# EAGLE design PCB-CMB-4 (EAGLE 7.5.0)

## Sheet 1 of 2
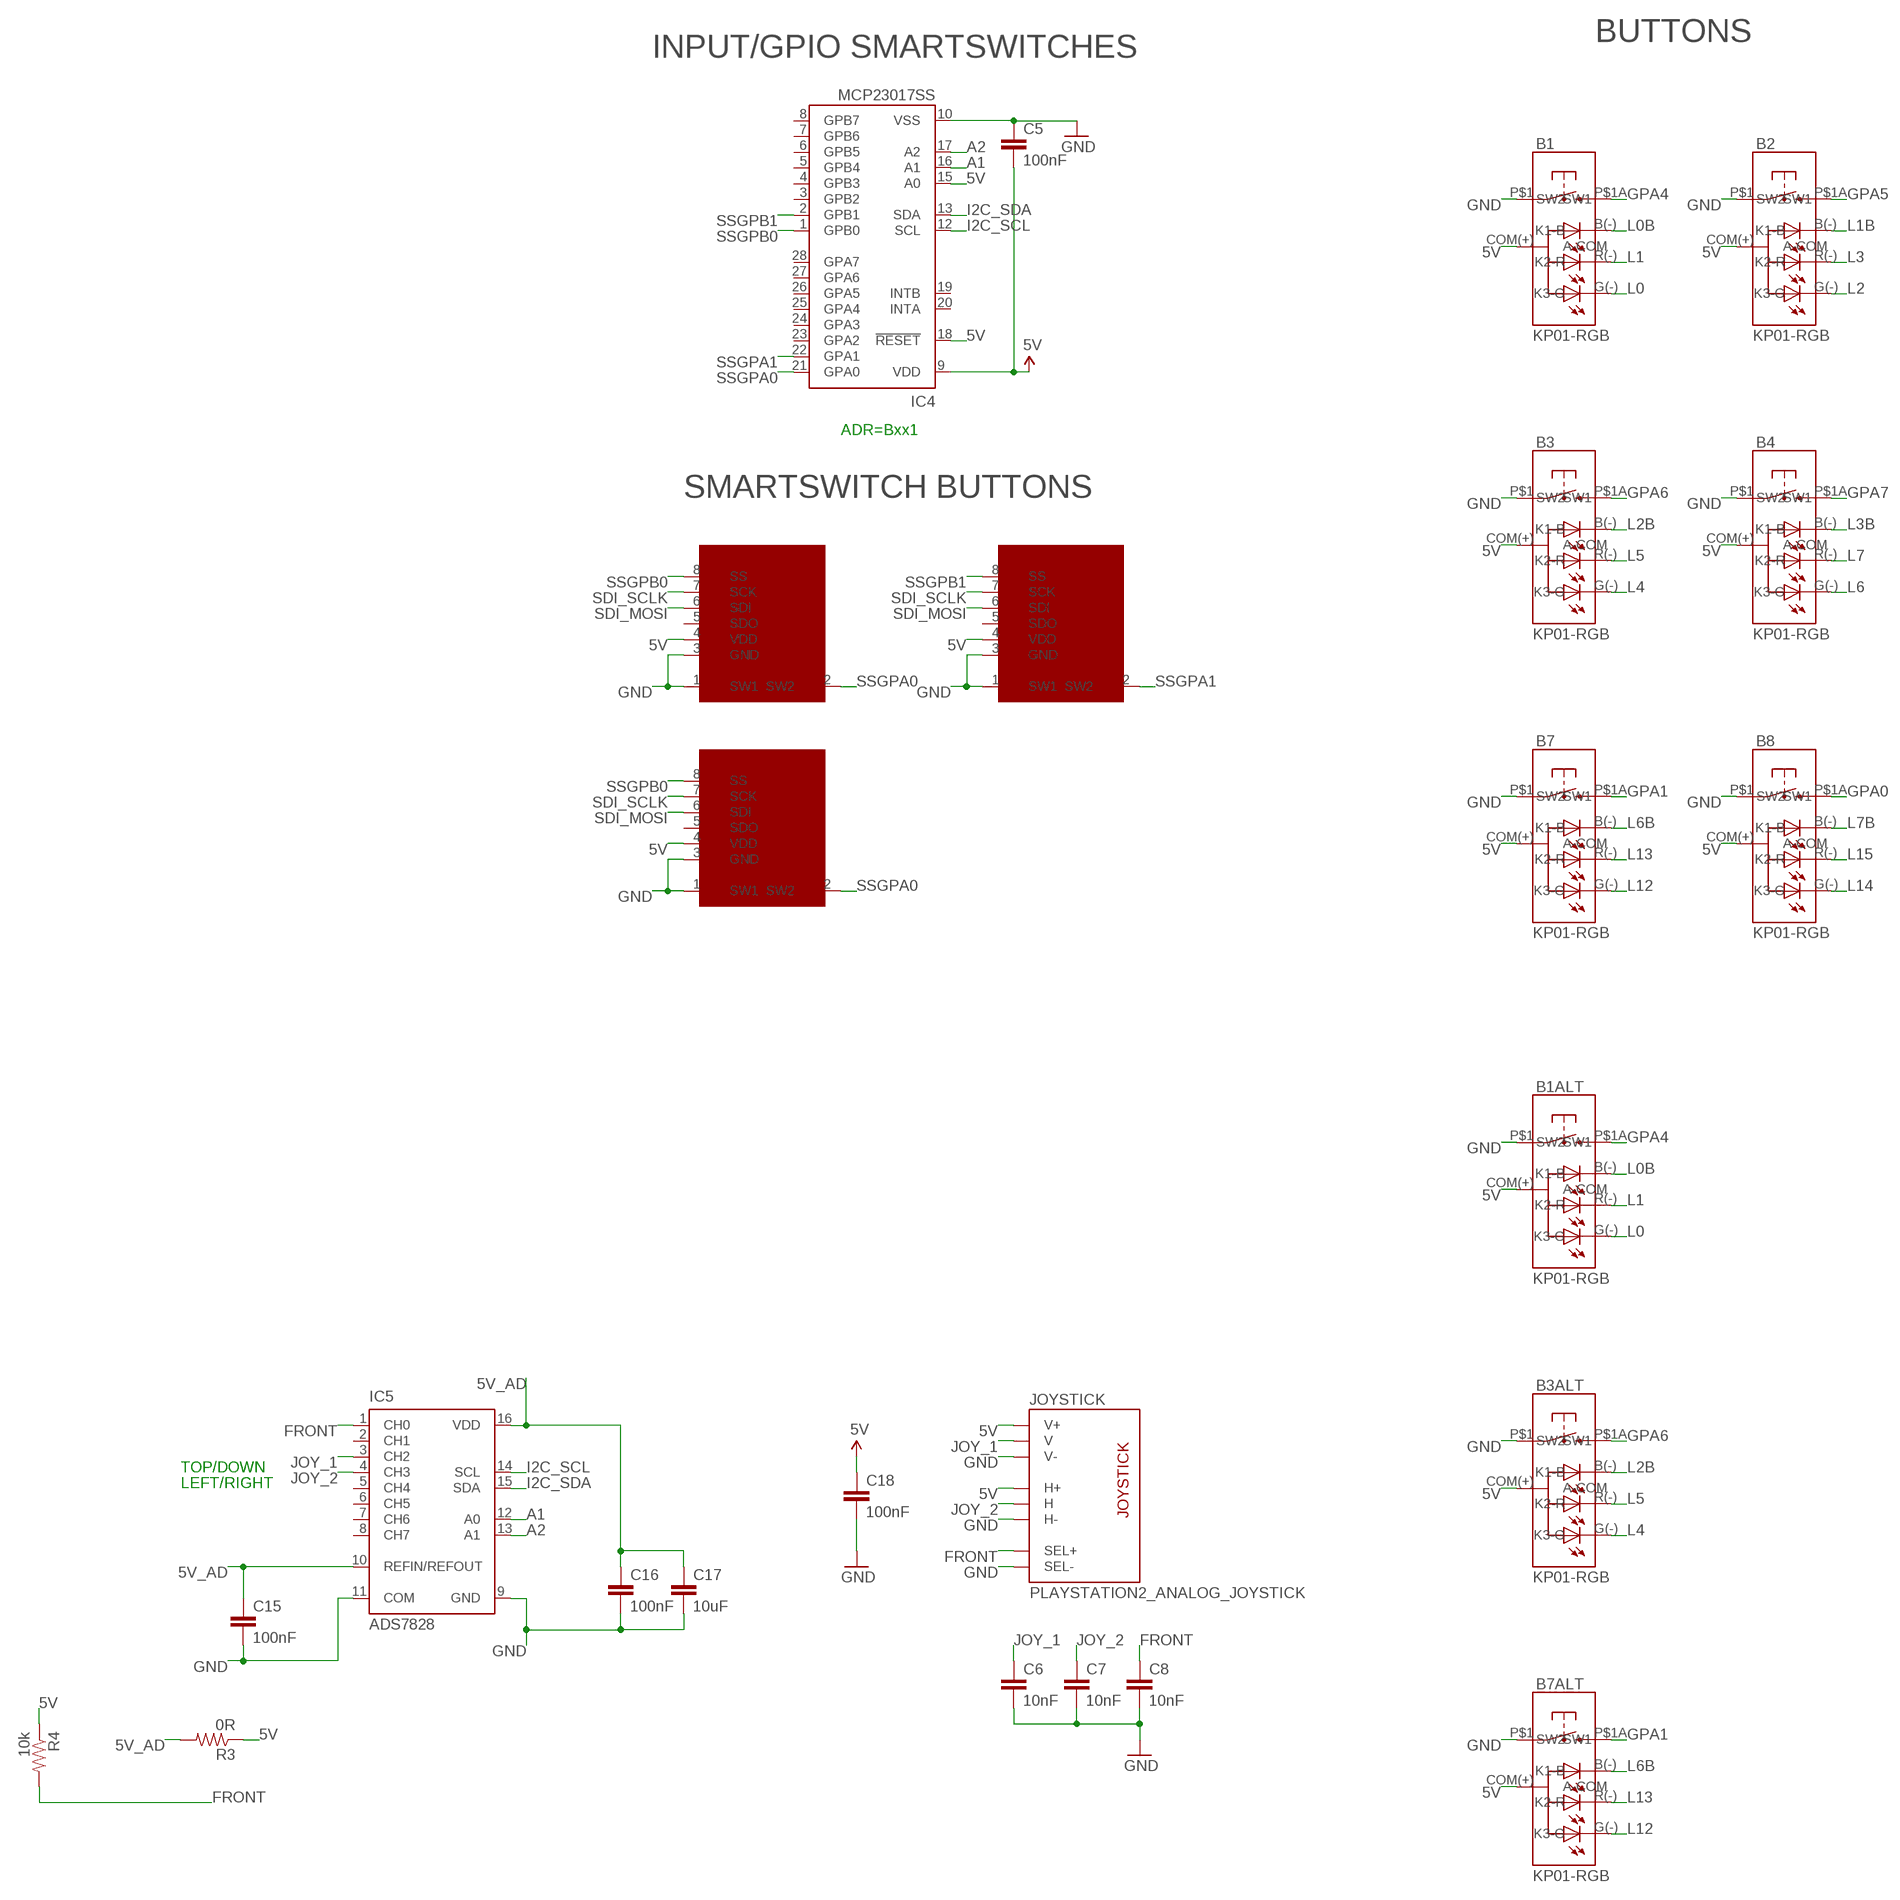
[diagram p0: schematic, sheet 1, part 1 of 2]
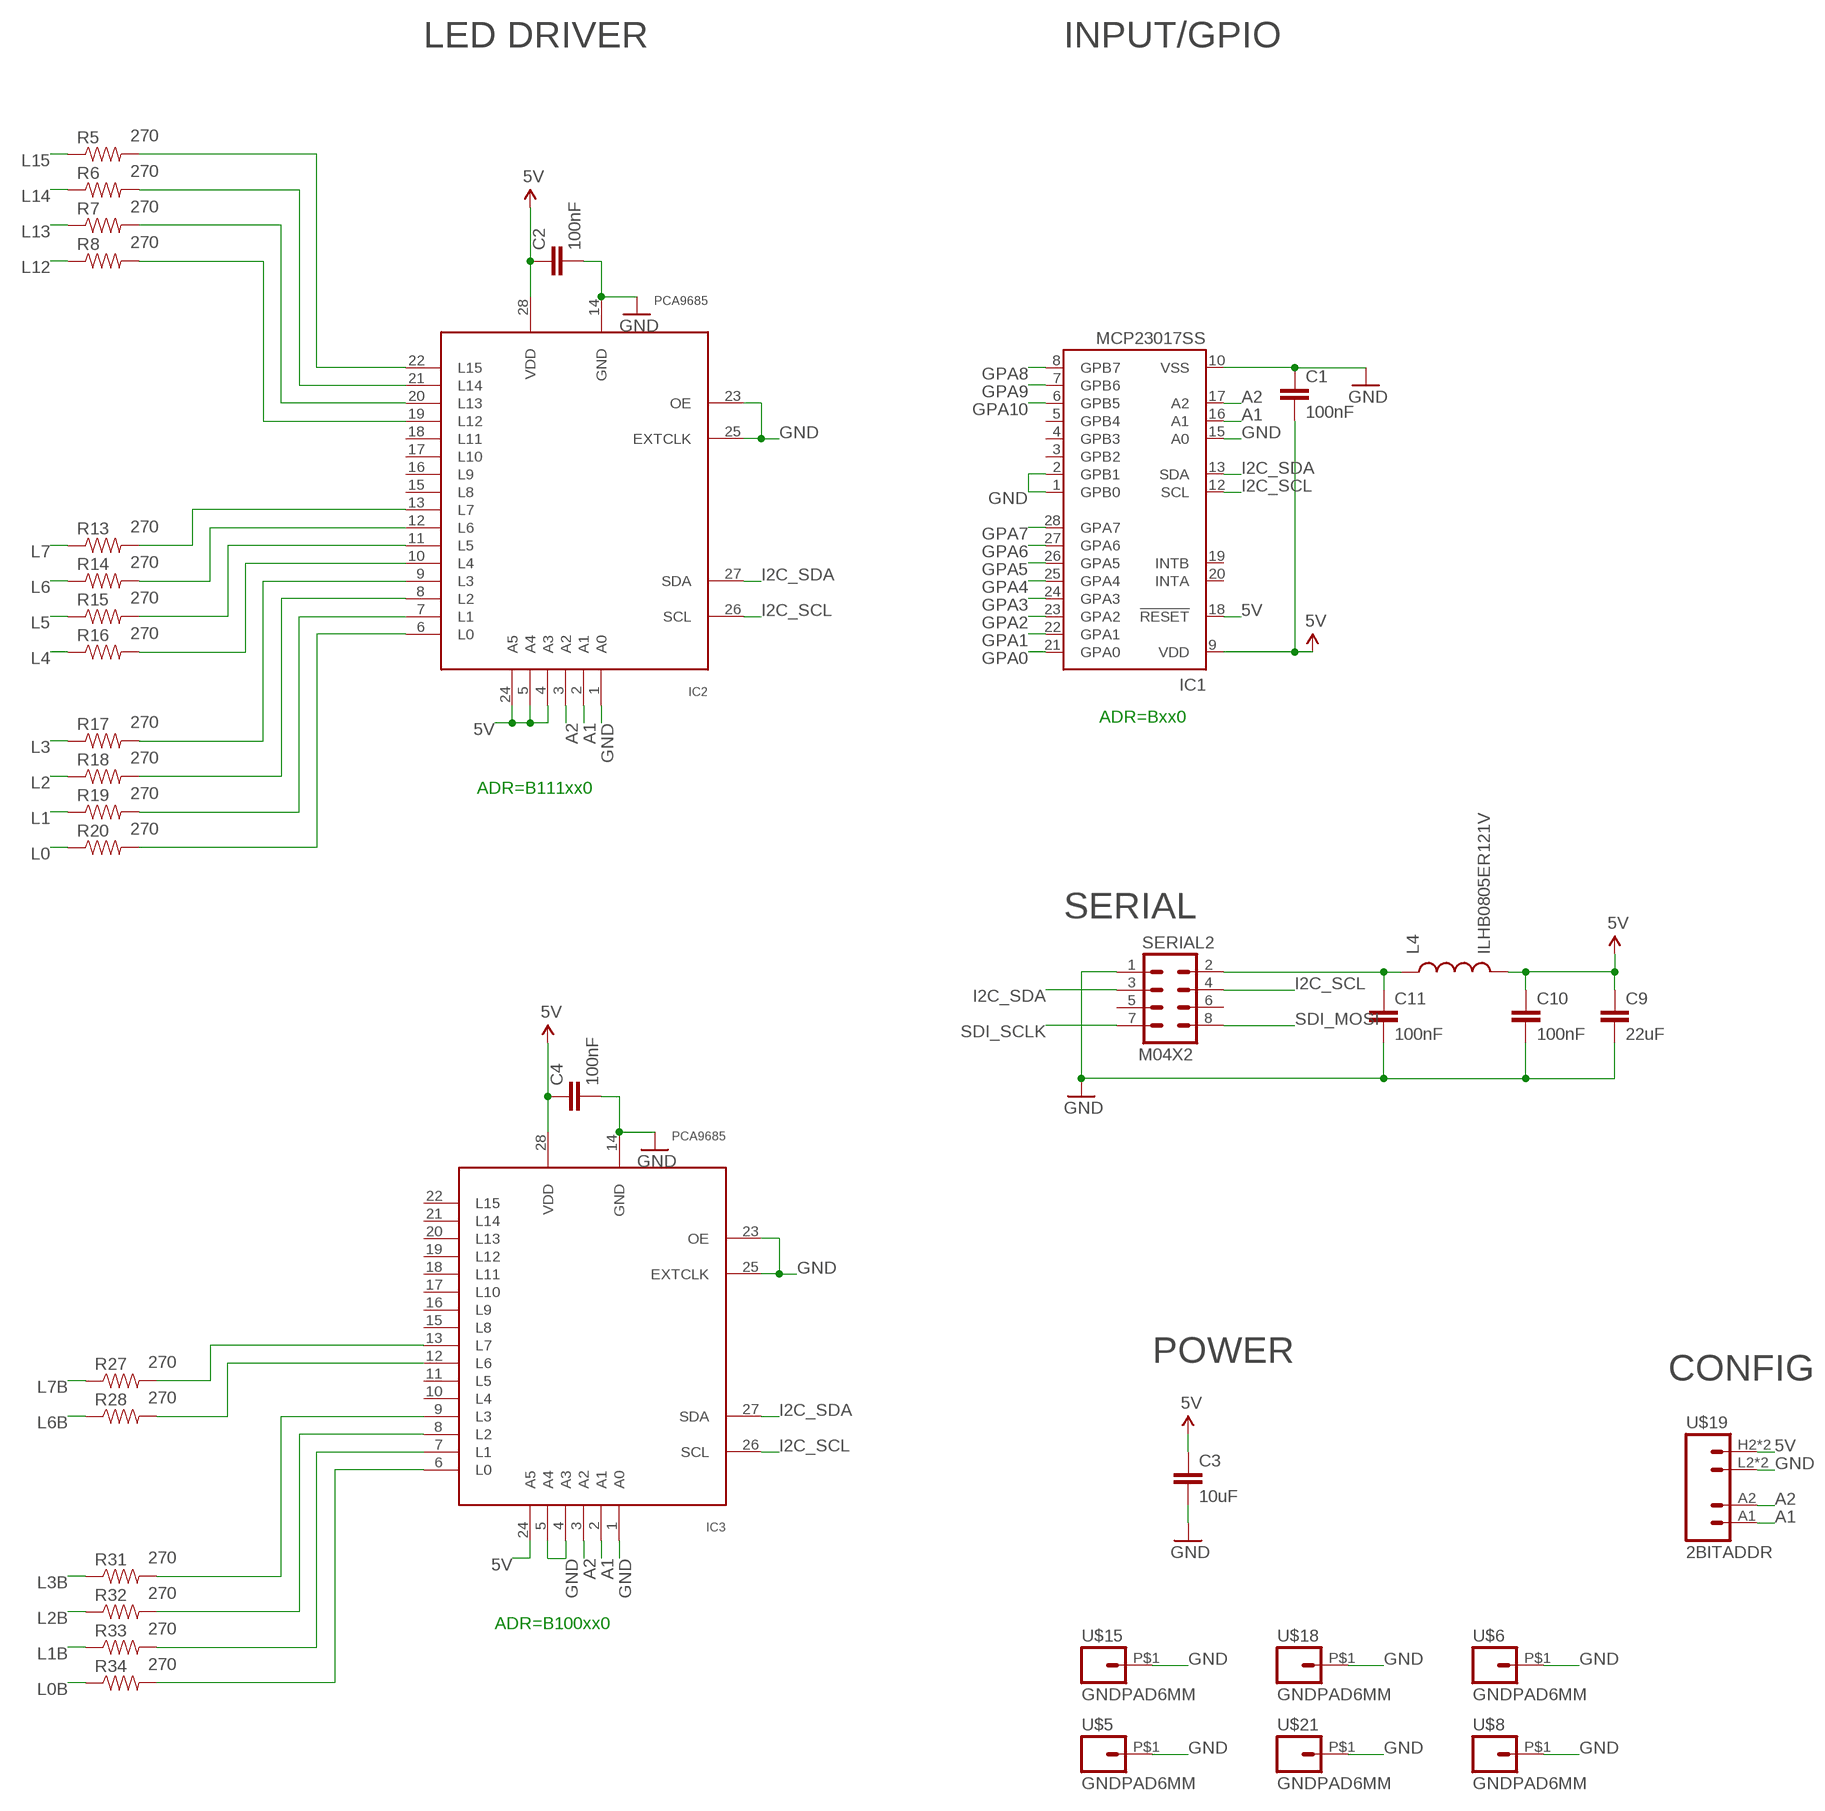
[diagram p1: schematic, sheet 1, part 2 of 2]

### Parts
B1  KP01-RGB  NKK-KP01  [NKK-KP01]
B1ALT  KP01-RGB  NKK-KP01  [NKK-KP01]
B2  KP01-RGB  NKK-KP01  [NKK-KP01]
B3  KP01-RGB  NKK-KP01  [NKK-KP01]
B3ALT  KP01-RGB  NKK-KP01  [NKK-KP01]
B4  KP01-RGB  NKK-KP01  [NKK-KP01]
B7  KP01-RGB  NKK-KP01  [NKK-KP01]
B7ALT  KP01-RGB  NKK-KP01  [NKK-KP01]
B8  KP01-RGB  NKK-KP01  [NKK-KP01]
C1  100nF  CAP0603-CAP  [0603-CAP]
C2  100nF  CAP0603-CAP  [0603-CAP]
C3  10uF  CAP0805  [0805]
C4  100nF  CAP0603-CAP  [0603-CAP]
C5  100nF  CAP0603-CAP  [0603-CAP]
C6  10nF  CAP0603-CAP  [0603-CAP]
C7  10nF  CAP0603-CAP  [0603-CAP]
C8  10nF  CAP0603-CAP  [0603-CAP]
C9  22uF  CAP0805  [0805]
C10  100nF  CAP0603-CAP  [0603-CAP]
C11  100nF  CAP0603-CAP  [0603-CAP]
C15  100nF  CAP0603-CAP  [0603-CAP]
C16  100nF  CAP0603-CAP  [0603-CAP]
C17  10uF  CAP0805  [0805]
C18  100nF  CAP0603-CAP  [0603-CAP]
IC1  MCP23017SS  [SSOP28]
IC2  PCA9685  [TSSOP28]
IC3  PCA9685  [TSSOP28]
IC4  MCP23017SS  [SSOP28]
IC5  ADS7828  [TSSOP16-PW]
JOYSTICK  PLAYSTATION2_ANALOG_JOYSTICK  [PLAYSTATION2_ANALOG_JOYSTICK]
L4  ILHB0805ER121V  INDUCTOR0805  [0805]
R3  0R  RESISTOR0603-RES  [0603-RES]
R4  10k  RESISTOR0603-RES  [0603-RES]
R5  270  RESISTOR0603-RES  [0603-RES]
R6  270  RESISTOR0603-RES  [0603-RES]
R7  270  RESISTOR0603-RES  [0603-RES]
R8  270  RESISTOR0603-RES  [0603-RES]
R13  270  RESISTOR0603-RES  [0603-RES]
R14  270  RESISTOR0603-RES  [0603-RES]
R15  270  RESISTOR0603-RES  [0603-RES]
R16  270  RESISTOR0603-RES  [0603-RES]
R17  270  RESISTOR0603-RES  [0603-RES]
R18  270  RESISTOR0603-RES  [0603-RES]
R19  270  RESISTOR0603-RES  [0603-RES]
R20  270  RESISTOR0603-RES  [0603-RES]
R27  270  RESISTOR0603-RES  [0603-RES]
R28  270  RESISTOR0603-RES  [0603-RES]
R31  270  RESISTOR0603-RES  [0603-RES]
R32  270  RESISTOR0603-RES  [0603-RES]
R33  270  RESISTOR0603-RES  [0603-RES]
R34  270  RESISTOR0603-RES  [0603-RES]
SERIAL2  M04X2  [2X4]
SSW1  SMART_SWITCHSMART_SWITCH_8PIN  [SMART_SWITCH]
SSW1ALT  SMART_SWITCHSMART_SWITCH_8PIN  [SMART_SWITCH]
SSW2  SMART_SWITCHSMART_SWITCH_8PIN  [SMART_SWITCH]
U$5  GNDPAD6MM  [3.2MMPAD6MM]
U$6  GNDPAD6MM  [3.2MMPAD6MM]
U$8  GNDPAD6MM  [3.2MMPAD6MM]
U$15  GNDPAD6MM  [3.2MMPAD6MM]
U$18  GNDPAD6MM  [3.2MMPAD6MM]
U$19  2BITADDR  [2BITADDR]
U$21  GNDPAD6MM  [3.2MMPAD6MM]

### Nets
5V [Power]: B1.COM(+)(A-COM) B1ALT.COM(+)(A-COM) B2.COM(+)(A-COM) B3.COM(+)(A-COM) B3ALT.COM(+)(A-COM) B4.COM(+)(A-COM) B7.COM(+)(A-COM) B7ALT.COM(+)(A-COM) B8.COM(+)(A-COM) C1.2 C2.1 C3.1 C4.1 C5.2 C9.1 C10.1 C18.1 IC1.9(VDD) IC1.18(!RESET) IC2.4(A3) IC2.5(A4) IC2.24(A5) IC2.28(VDD) IC3.24(A5) IC3.28(VDD) IC4.9(VDD) IC4.15(A0) IC4.18(!RESET) JOYSTICK.H1(H+) JOYSTICK.V1(V+) L4.2 R3.1 R4.1 SSW1.4(VDD) SSW1ALT.4(VDD) SSW2.4(VDD) U$19.H2(VCC) U$19.H3(VCC)
5V_AD [Power]: C15.1 C16.1 C17.1 IC5.10(REFIN/REFOUT) IC5.16(VDD) R3.2
A1: IC1.16(A1) IC2.2(A1) IC3.2(A1) IC4.16(A1) IC5.12(A0) U$19.A1
A2: IC1.17(A2) IC2.3(A2) IC3.3(A2) IC4.17(A2) IC5.13(A1) U$19.A2
FRONT: C8.1 IC5.1(CH0) JOYSTICK.B1A(SEL+) R4.2
GND [Power]: B1.P$1(SW1) B1ALT.P$1(SW1) B2.P$1(SW1) B3.P$1(SW1) B3ALT.P$1(SW1) B4.P$1(SW1) B7.P$1(SW1) B7ALT.P$1(SW1) B8.P$1(SW1) C1.1 C2.2 C3.2 C4.2 C5.1 C6.2 C7.2 C8.2 C9.2 C10.2 C11.2 C15.2 C16.2 C17.2 C18.2 IC1.1(GPB0) IC1.2(GPB1) IC1.10(VSS) IC1.15(A0) IC2.1(A0) IC2.14(GND) IC2.23(OE) IC2.25(EXTCLK) IC3.1(A0) IC3.4(A3) IC3.5(A4) IC3.14(GND) IC3.23(OE) IC3.25(EXTCLK) IC4.10(VSS) IC5.9(GND) IC5.11(COM) JOYSTICK.B2A(SEL-) JOYSTICK.H3(H-) JOYSTICK.V3(V-) SERIAL2.1 SSW1.1(SW1) SSW1.3(GND) SSW1ALT.1(SW1) SSW1ALT.3(GND) SSW2.1(SW1) SSW2.3(GND) U$5.P$1 U$6.P$1 U$8.P$1 U$15.P$1 U$18.P$1 U$19.L2(GND) U$19.L3(GND) U$21.P$1
GPA0: B8.P$1A(SW2) IC1.21(GPA0)
GPA1: B7.P$1A(SW2) B7ALT.P$1A(SW2) IC1.22(GPA1)
GPA2: IC1.23(GPA2)
GPA3: IC1.24(GPA3)
GPA4: B1.P$1A(SW2) B1ALT.P$1A(SW2) IC1.25(GPA4)
GPA5: B2.P$1A(SW2) IC1.26(GPA5)
GPA6: B3.P$1A(SW2) B3ALT.P$1A(SW2) IC1.27(GPA6)
GPA7: B4.P$1A(SW2) IC1.28(GPA7)
GPA8: IC1.8(GPB7)
GPA9: IC1.7(GPB6)
GPA10: IC1.6(GPB5)
I2C_SCL: IC1.12(SCL) IC2.26(SCL) IC3.26(SCL) IC4.12(SCL) IC5.14(SCL) SERIAL2.4
I2C_SDA: IC1.13(SDA) IC2.27(SDA) IC3.27(SDA) IC4.13(SDA) IC5.15(SDA) SERIAL2.3
JOY_1: C6.1 IC5.3(CH2) JOYSTICK.V2(V)
JOY_2: C7.1 IC5.4(CH3) JOYSTICK.H2(H)
L0: B1.G(-)(K3-G) B1ALT.G(-)(K3-G) R20.1
L0B: B1.B(-)(K1-B) B1ALT.B(-)(K1-B) R34.1
L1: B1.R(-)(K2-R) B1ALT.R(-)(K2-R) R19.1
L1B: B2.B(-)(K1-B) R33.1
L2: B2.G(-)(K3-G) R18.1
L2B: B3.B(-)(K1-B) B3ALT.B(-)(K1-B) R32.1
L3: B2.R(-)(K2-R) R17.1
L3B: B4.B(-)(K1-B) R31.1
L4: B3.G(-)(K3-G) B3ALT.G(-)(K3-G) R16.1
L5: B3.R(-)(K2-R) B3ALT.R(-)(K2-R) R15.1
L6: B4.G(-)(K3-G) R14.1
L6B: B7.B(-)(K1-B) B7ALT.B(-)(K1-B) R28.1
L7: B4.R(-)(K2-R) R13.1
L7B: B8.B(-)(K1-B) R27.1
L12: B7.G(-)(K3-G) B7ALT.G(-)(K3-G) R8.1
L13: B7.R(-)(K2-R) B7ALT.R(-)(K2-R) R7.1
L14: B8.G(-)(K3-G) R6.1
L15: B8.R(-)(K2-R) R5.1
N$1 [Power]: C11.1 L4.1 SERIAL2.2
N$2: IC3.13(L7) R27.2
N$3: IC3.12(L6) R28.2
N$4: IC2.13(L7) R13.2
N$5: IC2.12(L6) R14.2
N$7: IC2.11(L5) R15.2
N$9: IC2.10(L4) R16.2
N$10: IC2.9(L3) R17.2
N$11: IC2.8(L2) R18.2
N$12: IC2.7(L1) R19.2
N$14: IC3.9(L3) R31.2
N$15: IC3.8(L2) R32.2
N$16: IC3.7(L1) R33.2
N$17: IC3.6(L0) R34.2
N$19: IC2.6(L0) R20.2
N$24: IC2.19(L12) R8.2
N$25: IC2.20(L13) R7.2
N$26: IC2.21(L14) R6.2
N$27: IC2.22(L15) R5.2
SDI_MOSI: SERIAL2.8 SSW1.6(SDI) SSW1ALT.6(SDI) SSW2.6(SDI)
SDI_SCLK: SERIAL2.7 SSW1.7(SCK) SSW1ALT.7(SCK) SSW2.7(SCK)
SSGPA0: IC4.21(GPA0) SSW1.2(SW2) SSW1ALT.2(SW2)
SSGPA1: IC4.22(GPA1) SSW2.2(SW2)
SSGPB0: IC4.1(GPB0) SSW1.8(SS) SSW1ALT.8(SS)
SSGPB1: IC4.2(GPB1) SSW2.8(SS)
Unconnected: IC1.3(GPB2) IC1.4(GPB3) IC1.5(GPB4) IC1.19(INTB) IC1.20(INTA) IC2.15(L8) IC2.16(L9) IC2.17(L10) IC2.18(L11) IC3.10(L4) IC3.11(L5) IC3.15(L8) IC3.16(L9) IC3.17(L10) IC3.18(L11) IC3.19(L12) IC3.20(L13) IC3.21(L14) IC3.22(L15) IC4.3(GPB2) IC4.4(GPB3) IC4.5(GPB4) IC4.6(GPB5) IC4.7(GPB6) IC4.8(GPB7) IC4.19(INTB) IC4.20(INTA) IC4.23(GPA2) IC4.24(GPA3) IC4.25(GPA4) IC4.26(GPA5) IC4.27(GPA6) IC4.28(GPA7) IC5.2(CH1) IC5.5(CH4) IC5.6(CH5) IC5.7(CH6) IC5.8(CH7) SERIAL2.5 SERIAL2.6 SSW1.5(SDO) SSW1ALT.5(SDO) SSW2.5(SDO)

### Notes on the sheet
- LED DRIVER | INPUT/GPIO
- BUTTONS
- INPUT/GPIO SMARTSWITCHES
- ADR=Bxx1
- SMARTSWITCH BUTTONS
- ADR=Bxx0
- ADR=B111xx0
- SERIAL
- POWER
- CONFIG
- ADR=B100xx0
- TOP/DOWN
- LEFT/RIGHT

## Sheet 2 of 2

## Library data of the parts
B1 B1ALT B2 B3 B3ALT B4 B7 B7ALT B8 = SKAARHOJ:NKK-KP01: NKK-KP01-15AC 100mA12VDC
C1-C11 C15-C18 = SparkFun:CAP: Capacitor Standard 0603 ceramic capacitor, and 0.1" leaded capacitor.
IC1 IC4 = microchip:MCP23017: http://ww1.microchip.com/downloads/en/DeviceDoc/21952a.pdf Source: http://ww1.microchip.com/downloads/en/DeviceDoc/21952a.pdf; MF: MICROCHIP; MPN: MCP23017-E/SS; OC_FARNELL: 1467674; OC_NEWARK: 31K2960
IC2 IC3 = wsmith:PCA9685
IC5 = burr-brown:ADS7828: 12-Bit, 8-Channel Sampling ANALOG-TO-DIGITAL CONVERTER with I2C? Interface Source: www.ti.com .. ADS7828.pdf; MF: TEXAS INSTRUMENTS; MPN: ADS7828E/250; OC_FARNELL: 1470338; OC_NEWARK: 74C7158
JOYSTICK = SKAARHOJ:PLAYSTATION2_ANALOG_JOYSTICK: Playstation2 Analog Joystick with a Switch
L4 = SparkFun:INDUCTOR: Inductors Basic Inductor/Choke - 0603 and 1206. Footprints are not proven and vary greatly between part numbers.
R3-R8 R13-R20 R27 R28 R31-R34 = SparkFun:RESISTOR: Resistor Basic schematic elements and footprints for 0603, 1206, and PTH resistors.
SERIAL2 = SparkFun:M04X2
SSW1 SSW1ALT SSW2 = SKAARHOJ:SMART_SWITCH: SMARTSWITCH IS15DSBFP4RGB www.nkksmartswitch.com
U$5 U$6 U$8 U$15 U$18 U$21 = SKAARHOJ:GNDPAD
U$19 = SKAARHOJ:2BITADDR

## Net classes
0 default: width 0.203 mm, drill 0.406 mm, clearance 0.203 mm
1 Power: width 0.406 mm, drill 0.61 mm, clearance 0.203 mm

## Board
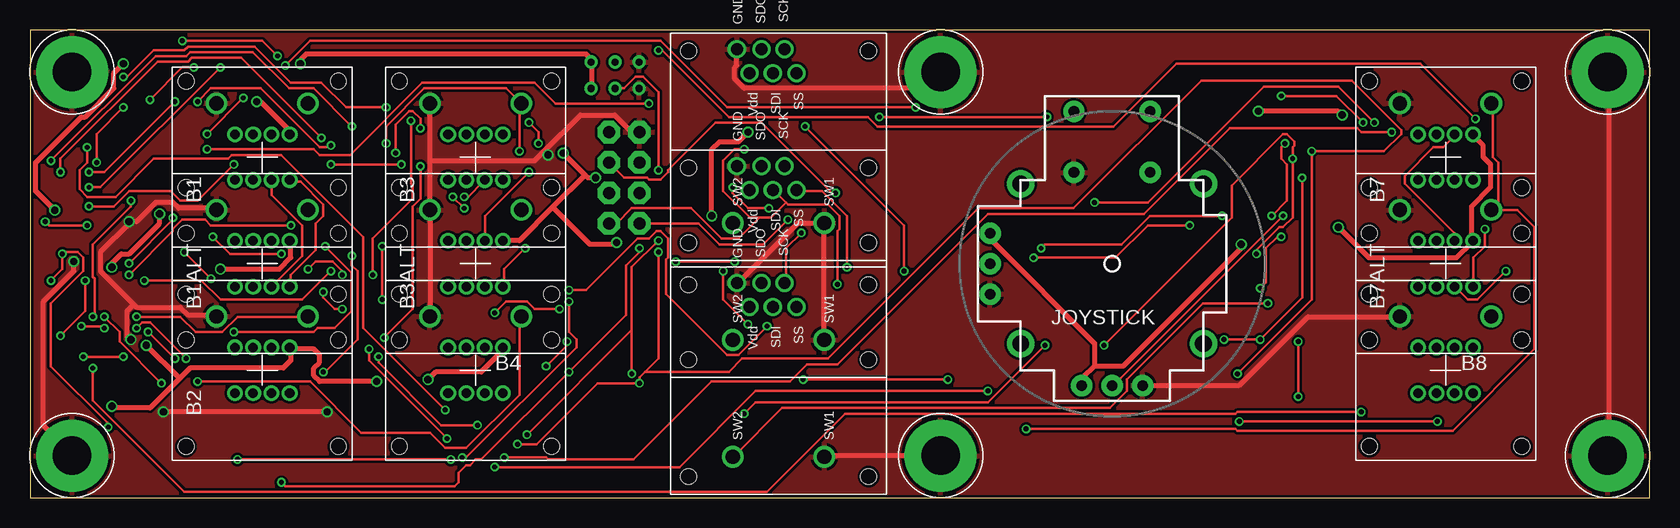
[diagram p2: board, top side]
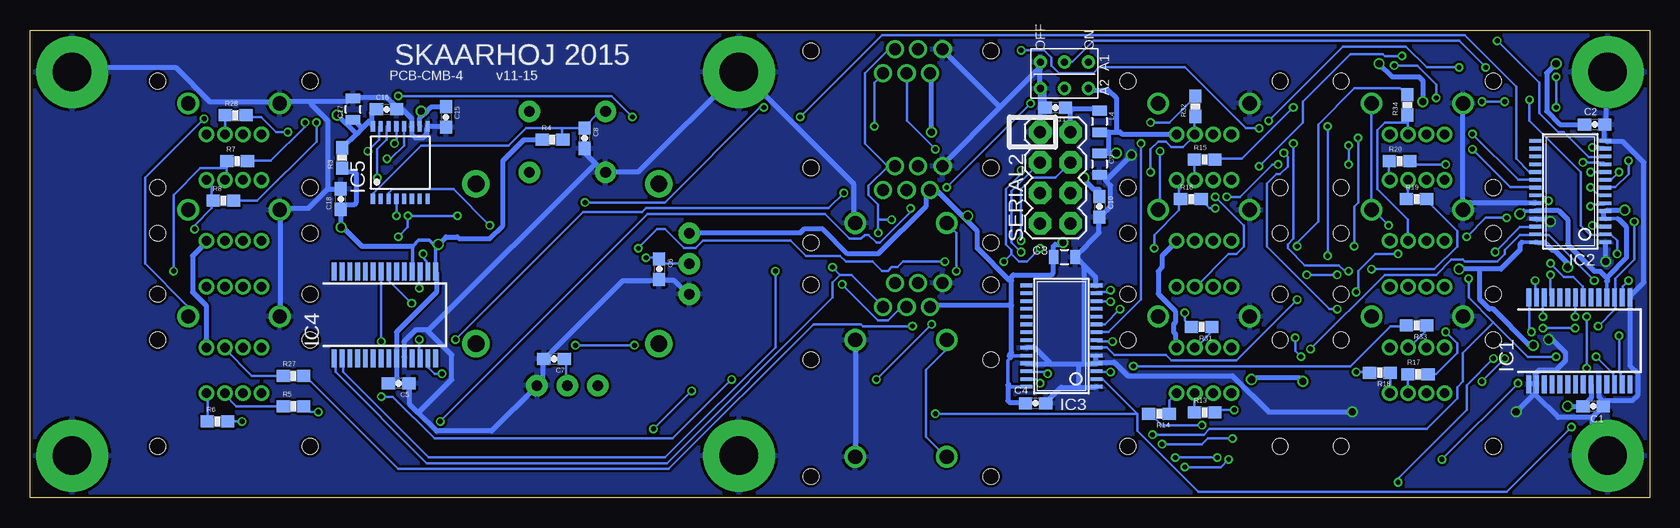
[diagram p3: board, bottom side, seen from below]

Size 135 x 39 mm. Coordinates in mm from the lower left corner, seen from the top.
Outline: 0,0 135,0 135,39 0,39 0,0
Copper layers (1*16): Top 0.035mm / dielectric 1.5mm / Bottom 0.035mm
Design rules "Fusion_eagle_rule_v1.1": minimum track width 6mil, minimum drill 12mil, track to track 6mil, track to pad 6mil, pad to pad 6mil, via to via 6mil, smd to smd 0mil, copper to edge 10mil, drill to drill 10mil, minimum pad ring 10mil, minimum via ring 6mil, stop-mask expansion 2mil, vias tented up to drill 100mil, thermal gap 10mil

### Footprints (pad centres in the part's own frame; a part is rotated, then mirrored left to right if it is on the bottom)
NKK-KP01 = drill 0.8: B(-) 1.905,-0.762; COM(+) 1.905,-2.286; G(-) -1.905,-2.286; P$3 1.905,0.762; P$4 1.905,2.286; P$7 -1.905,0.762; P$8 -1.905,2.286; R(-) -1.905,-0.762 | drill 1.2: P$1 4.496,3.81; P$1A 4.496,-3.81 | hole 1.3: -6.35,6.35; 6.35,6.35; 6.35,-6.35; -6.35,-6.35
0603-CAP = smd 1.1 x 1: 1 -0.85,0; 2 0.85,0
0805 = smd 0.8 x 1.2: 1 -0.9,0; 2 0.9,0
SSOP28 = smd 0.4 x 1.5: 1 -4.225,-3.625; 2 -3.575,-3.625; 3 -2.925,-3.625; 4 -2.275,-3.625; 5 -1.625,-3.625; 6 -0.975,-3.625; 7 -0.325,-3.625; 8 0.325,-3.625; 9 0.975,-3.625; 10 1.625,-3.625; 11 2.275,-3.625; 12 2.925,-3.625; 13 3.575,-3.625; 14 4.225,-3.625; 15 4.225,3.625; 16 3.575,3.625; 17 2.925,3.625; 18 2.275,3.625; 19 1.625,3.625; 20 0.975,3.625; 21 0.325,3.625; 22 -0.325,3.625; 23 -0.975,3.625; 24 -1.625,3.625; 25 -2.275,3.625; 26 -2.925,3.625; 27 -3.575,3.625; 28 -4.225,3.625
TSSOP28 = smd 0.305 x 0.991: 1 -4.225,-2.918; 2 -3.575,-2.918; 3 -2.925,-2.918; 4 -2.275,-2.918; 5 -1.625,-2.918; 6 -0.975,-2.918; 7 -0.325,-2.918; 8 0.325,-2.918; 9 0.975,-2.918; 10 1.625,-2.918; 11 2.275,-2.918; 12 2.925,-2.918; 13 3.575,-2.918; 14 4.225,-2.918; 15 4.225,2.918; 16 3.575,2.918; 17 2.925,2.918; 18 2.275,2.918; 19 1.625,2.918; 20 0.975,2.918; 21 0.325,2.918; 22 -0.325,2.918; 23 -0.975,2.918; 24 -1.625,2.918; 25 -2.275,2.918; 26 -2.925,2.918; 27 -3.575,2.918; 28 -4.225,2.918
TSSOP16-PW = smd 0.35 x 0.9: 1 -2.275,-3.025; 2 -1.625,-3.025; 3 -0.975,-3.025; 4 -0.325,-3.025; 5 0.325,-3.025; 6 0.975,-3.025; 7 1.625,-3.025; 8 2.275,-3.025; 9 2.275,3.025; 10 1.625,3.025; 11 0.975,3.025; 12 0.325,3.025; 13 -0.325,3.025; 14 -0.975,3.025; 15 -1.625,3.025; 16 -2.275,3.025
PLAYSTATION2_ANALOG_JOYSTICK = drill 0.9 pad 1.778: B1A -3.175,12.7; B1B 3.175,12.7; B2A -3.175,7.62; B2B 3.175,7.62 | drill 0.889 pad 1.778: H1 -2.54,-10.16; H2 0,-10.16; H3 2.54,-10.16; V1 -10.16,2.54; V2 -10.16,0; V3 -10.16,-2.54 | drill 1.397 pad 2.286: MOUNT1 -7.62,6.668; MOUNT2 -7.62,-6.668; MOUNT3 7.62,-6.668; MOUNT4 7.62,6.668
0603-RES = smd 1.1 x 1: 1 -0.85,0; 2 0.85,0
2X4 = drill 1.016 pad 1.88 octagon: 1 -3.81,-1.27; 2 -3.81,1.27; 3 -1.27,-1.27; 4 -1.27,1.27; 5 1.27,-1.27; 6 1.27,1.27; 7 3.81,-1.27; 8 3.81,1.27
SMART_SWITCH = drill 1.2: 1 6.35,3.81; 2 6.35,-3.81 | drill 1: 3 -8.153,-3.48; 4 -6.147,-2.413; 5 -8.153,-1.422; 6 -6.147,-0.483; 7 -8.153,0.508; 8 -6.147,1.499 | hole 1.3: -8.001,7.506; 8.001,7.506; 8.001,-7.506; -8.001,-7.506
3.2MMPAD6MM = drill 3.2 pad 6: P$1 0,0
2BITADDR = drill 0.6: A1 0,0; A2 2.2,0; H2 0,2; H3 2.2,2; L2 0,-2; L3 2.2,-2

### Placement (x,y rotation side)
B1  19.36,28.39 90 top
B1ALT  19.36,19.5 90 top
B2  19.36,10.61 90 top
B3  37.14,28.39 90 top
B3ALT  37.14,19.5 90 top
B4  37.14,10.61 90 top
B7  118,28.39 90 top
B7ALT  118,19.5 90 top
B8  118,10.61 90 top
C1  4.7,7.62 180 bottom
C2  4.57,31.11 0 bottom
C3  48.77,20.07 0 bottom
C4  51.18,7.87 0 bottom
C5  104.27,9.53 180 bottom
C6  82.55,19.05 270 bottom
C7  91.31,11.56 180 bottom
C8  88.77,29.97 270 bottom
C9  45.85,27.81 270 bottom
C10  45.85,24.26 270 bottom
C11  49.53,32.51 180 bottom
C15  100.33,31.75 270 bottom
C16  105.28,32.38 0 bottom
C17  108.08,32.38 90 bottom
C18  109.09,24.89 90 bottom
IC1  5.84,13.08 0 bottom
IC2  6.6,25.53 90 bottom
IC3  49.02,13.46 90 bottom
IC4  105.41,15.24 0 bottom
IC5  104.14,27.94 0 bottom
JOYSTICK  90.2,19.5 0 top
L4  45.85,31.37 270 bottom
R3  108.97,28.32 90 bottom
R4  91.44,29.84 0 bottom
R5  113.03,7.62 0 bottom
R6  119.38,6.35 0 bottom
R7  117.73,28.07 0 bottom
R8  118.87,24.77 0 bottom
R13  37.08,7.11 0 bottom
R14  40.89,6.99 180 bottom
R15  37.08,28.19 0 bottom
R16  38.23,24.89 0 bottom
R17  19.3,10.29 0 bottom
R18  22.48,10.41 180 bottom
R19  19.43,24.89 0 bottom
R20  20.83,28.07 0 bottom
R27  113.03,10.16 0 bottom
R28  117.86,31.88 0 bottom
R31  37.34,14.22 180 bottom
R32  37.85,32.64 90 bottom
R33  19.43,14.35 180 bottom
R34  20.19,32.77 90 bottom
SERIAL2  49.53,26.67 270 bottom
SSW1  62.4,9.75 270 top
SSW1ALT  62.4,19.5 270 top
SSW2  62.4,29.25 270 top
U$5  3.5,3.5 0 top
U$6  131.5,35.5 0 top
U$8  131.5,3.5 0 top
U$15  3.5,35.5 0 top
U$18  75.9,3.5 0 top
U$19  48.77,36.32 270 bottom
U$21  75.9,35.5 0 top

### Tracks (layer width: path | path; a pad name or v marks a point on that pad's centre or on a via)
5V  (via drill 0.61)
  Top 0.406: v7.78,36.2 6.99,35.4 6.99,34.13 4.6,31.75 4.29,31.75 0.48,27.94 0.48,25.56 v2.06,23.97 | v10.79,23.65 10.79,22.86 8.26,20.32 7.62,20.32 6.83,19.53 v6.83,19.21 | v15.88,19.05 20.8,19.05 21.75,20 21.75,21.27 B1ALT.COM(+) | v6.83,7.62 6.99,7.46 10,7.46 12.46,9.92 | 12.46,9.92 13.34,10.79 21.11,10.79 21.75,11.43 21.75,12.38 B2.COM(+) 21.91,12.38 23.65,12.38 24.13,11.91 24.13,11.27 23.65,10.79 23.65,10.16 24.13,9.68 v28.89,9.68 | 12.46,9.92 v9.68,12.7 | v47.15,26.67 46.51,26.67 46.28,26.91 | v44.45,28.73 46.28,26.91 | 46.28,26.91 43.58,24.21 | 43.58,24.21 40.8,21.43 39.53,21.43 B3ALT.COM(+) | U$19.H3 46.83,34.13 46.83,36.2 U$19.H2 46.83,36.51 46.35,36.99 23.02,36.99 22.54,36.51 v22.54,36.2 | v18.89,33.02 19.21,33.02 21.59,30.64 21.59,30.32 B1.COM(+) | v33.18,9.84 33.81,10.48 37.62,10.48 39.53,12.38 B4.COM(+) | B7.COM(+) 120.33,30.16 121.13,29.37 121.13,28.42 121.76,27.78 121.76,25.88 120.17,24.29 120.17,21.43 B7ALT.COM(+) 120.17,21.27 118.9,20 111.6,20 v109.06,22.54 | 88.74,10.95 87.79,10 87.79,9.37 JOYSTICK.H1 | 88.74,10.95 91.12,10.95 100.97,20.8 v100.97,21.11 | v59.85,30.48 59.05,29.69 57.47,29.69 56.83,29.05 v56.83,23.5 | 88.74,10.95 88.74,12.86 80.17,21.43 80.17,21.91 JOYSTICK.V1 | 43.58,24.21 46.67,21.11 48.74,21.11 v48.9,21.27
  Bottom 0.305: IC4.15 101.19,20.92 101.73,21.46 102.62,21.46 103.12,20.95 IC4.18 | IC3.28 53.18,9.24 53.4,9.46 53.47,9.53 53.47,11.43 53.24,11.65 53.09,11.81 51.97,11.81 IC3.24 | IC2.28 10.63,21.3 10.67,21.34 | IC2.24 10.52,23.9 10.54,23.88 | IC1.18 3.57,18.02 3.56,18.03 | IC2.4 2.68,23.25 2.67,23.24
  Bottom 0.406: IC1.9 4.87,8.3 C1.2 v6.83,7.62 | IC2.4 3.81,23.34 3.81,23.81 IC2.5 3.49,23.97 v2.06,23.97 | 3.49,18.41 1.91,20 1.91,22.54 2.54,23.18 2.67,23.24 | 3.49,18.41 3.49,18.1 3.57,18.02 | C2.1 7.46,31.11 8.57,32.23 8.57,35.4 v7.78,36.2 | v10.79,23.65 10.64,23.81 10.52,23.9 | v6.83,19.21 6.83,19.53 7.94,20.64 8.1,20.64 8.73,21.27 9.37,21.27 IC2.28 | 14.13,19.05 12.38,19.05 10.79,20.64 10.79,21.11 10.64,21.27 10.63,21.3 | 14.13,19.05 v15.88,19.05 | 14.13,19.05 14.13,16.51 13.34,15.72 13.02,15.72 10,12.7 v9.68,12.7 | 3.49,18.41 3.65,18.41 4.13,18.89 4.6,18.89 6.83,21.11 6.83,23.18 7.62,23.97 9.37,23.97 IC2.24 | B4.COM(+) 39.53,12.54 39.53,13.65 39.69,13.81 39.69,14.45 39.53,14.61 39.53,15.56 40.96,16.99 40.96,18.89 40.64,19.21 40.64,20.16 39.53,21.27 B3ALT.COM(+) | v47.15,26.67 47.15,26.51 46.35,25.72 45.88,25.72 45.88,25.24 C10.1 | 45.09,28.73 45.72,28.73 C9.1 | 45.09,28.73 v44.45,28.73 | 45.09,30.48 45.72,30.48 L4.2 | 45.09,30.48 44.45,30.48 | 44.45,30.48 44.13,30.48 43.97,30.32 39.53,30.32 B3.COM(+) | 45.09,30.48 45.09,28.73 | v18.89,33.02 18.89,34.77 19.21,35.08 21.43,35.08 v22.54,36.2 | 44.45,30.48 44.45,33.34 45.09,33.97 46.67,33.97 U$19.H3 | v28.89,9.68 29.21,10 33.02,10 v33.18,9.84 | B8.COM(+) 120.33,12.54 120.33,16.03 121.44,17.14 121.44,20.16 120.33,21.27 B7ALT.COM(+) | R3.1 108.9,27.46 108.9,27.15 107.95,27.15 107.79,26.99 107.79,24.61 107.95,24.45 109.06,24.45 109.06,24.13 C18.1 109.06,23.97 109.06,22.7 | C5.2 104.62,9.53 104.46,9.68 104.46,11.59 IC4.9 104.46,11.75 104.46,13.81 101.12,17.14 101.12,18.73 IC4.15 | R4.1 93.82,29.84 95.57,28.1 95.57,22.7 96.68,21.59 99.22,21.59 99.38,21.75 100.33,21.75 v100.97,21.11 101.12,20.95 101.19,20.92
  Bottom 0.406: 109.06,22.7 107.31,20.95 103.12,20.95 | v109.06,22.54 109.06,22.7 | C4.1 52.07,7.94 53.34,7.94 53.5,8.1 53.5,9.37 53.4,9.46 | 53.18,16.03 53.18,12.06 53.34,11.91 53.34,11.75 53.24,11.65 | 53.18,16.03 53.18,18.1 | 53.18,18.1 53.18,18.41 53.02,18.57 49.85,18.57 49.69,18.73 49.69,20 C3.1 49.69,20.16 49.69,20.95 49.53,21.11 49.05,21.11 v48.9,21.27 | 53.18,16.03 59.85,16.03 SSW1.4 | 57.07,23.26 56.04,22.23 56.04,20.8 53.34,18.1 53.18,18.1 | 57.07,23.26 59.37,25.56 59.85,25.56 SSW1ALT.4 60.17,25.56 60.33,25.4 60.33,24.29 64.29,20.32 66.83,20.32 68.9,22.38 70.48,22.38 70.8,22.07 80.01,22.07 JOYSTICK.V1 | v59.85,30.48 59.85,35.24 SSW2.4 | 57.07,23.26 v56.83,23.5
5V_AD  (via drill 0.61)
  Top 0.406: v102.39,32.23 109.06,32.23 v109.38,31.91
  Bottom 0.406: 102.16,31.99 101.6,32.54 100.33,32.54 C15.1 | 102.16,31.99 102.55,31.59 102.55,31.11 IC5.10 | 106.52,31.43 106.52,32.07 106.2,32.38 C16.1 | 106.52,31.43 106.52,31.11 IC5.16 | 107.31,30.8 106.68,31.43 106.52,31.43 | 107.31,30.8 107.79,30.32 | 107.79,30.32 108.9,29.21 R3.2 | 107.31,30.8 107.95,31.43 C17.1 | v102.39,32.23 102.16,31.99 | 107.79,30.32 v109.38,31.91
A1  (via drill 0.41)
  Top 0.203: v102.23,20.32 102.23,20.64 104.14,22.54 104.46,22.54 105.25,23.34 v105.25,28.26 105.25,29.21 105.41,29.37 105.41,29.69 104.78,30.32 104.46,30.32 100.17,26.04 100.17,23.34 v89.53,12.7 | v1.75,18.1 2.7,19.05 v2.7,20.32 2.86,20.48 3.97,20.48 4.45,20 4.45,18.89 1.75,16.19 1.75,10.95 6.51,6.19 v6.51,5.87 | v13.65,35.88 12.7,35.88 v10,33.18 | v84.61,12.7 79.85,7.94 60.48,7.94 v59.53,6.99
  Bottom 0.203: v105.25,28.26 104.93,28.26 103.82,29.37 103.82,30.96 IC5.12 | v102.23,20.32 102.23,20 101.92,19.68 101.92,18.89 IC4.16 | v2.7,20.32 2.7,21.43 3.17,21.91 3.65,21.91 IC2.2 3.81,21.91 4.92,21.91 5.71,22.7 5.71,27.15 10,31.43 v10,33.18 | v1.75,18.1 2.22,17.62 2.22,16.83 IC1.16 | 42.7,6.99 45.56,9.84 46.04,9.84 IC3.2 | 42.7,6.99 42.7,5.56 37.62,0.48 11.91,0.48 v6.51,5.87 | v13.65,35.88 15.88,38.1 46.35,38.1 48.1,36.35 48.74,36.35 U$19.A1 | v84.61,12.7 v89.53,12.7 | 42.7,6.99 v59.53,6.99
A2  (via drill 0.41)
  Top 0.203: v104.62,29.53 104.3,29.21 104.3,28.26 104.78,27.78 104.78,24.77 v103.5,23.5 | v104.3,21.75 103.98,21.75 103.03,20.8 103.03,17.94 v102.55,17.46 | v4.76,22.7 1.59,22.7 v1.27,23.02 | v52.39,27.3 52.39,33.81 51.12,35.08 50.48,35.08 49.53,34.13 48.9,34.13 U$19.A2 | v50.8,20.8 50.8,20.48 49.69,19.37 49.69,15.24 v44.93,10.48 37.62,3.17 37.15,3.17 36.67,2.7 36.35,2.7 35.72,2.06 35.72,1.27 35.4,0.95 21.27,0.95 v20.95,1.27 | v4.29,14.29 6.03,14.29 v6.19,14.13 | v8.89,14.13 9.37,14.61 10,14.61 v13.02,11.59 | v99.38,23.5 93.34,23.5 90.96,21.11 84.61,21.11 v84.3,20.8 | v53.82,19.68 v58.74,19.68
  Bottom 0.203: v104.62,29.53 104.46,29.69 104.46,30.96 IC5.13 | v104.3,21.75 103.5,22.54 v103.5,23.5 v99.38,23.5 | v102.55,17.46 102.55,18.73 IC4.17 | v4.76,22.7 4.6,22.54 3.81,22.54 IC2.3 | v1.27,23.02 1.27,19.84 2.86,18.26 2.86,16.83 IC1.17 2.86,16.67 2.86,15.72 v4.29,14.29 | v52.39,27.3 52.39,26.99 53.66,25.72 53.66,21.11 53.18,20.64 53.18,20.32 | 53.18,20.32 52.55,19.68 51.91,19.68 v50.8,20.8 | v44.93,10.48 46.04,10.48 IC3.3 | v8.89,14.13 v6.19,14.13 | v13.02,11.59 15.24,9.37 15.24,7.3 20.95,1.59 v20.95,1.27 | v84.3,20.8 82.71,22.38 82.07,22.38 80.49,20.8 79.53,20.8 78.9,21.43 71.6,21.43 70.33,20.16 67.47,20.16 66.99,19.68 64.77,19.68 63.98,18.89 63.5,18.89 63.18,19.21 62.71,19.21 62.23,19.68 v58.74,19.68 | 53.18,20.32 v53.82,19.68
FRONT
  Bottom 0.203: 90.65,30.8 88.9,30.8 C8.1 88.74,30.96 87.63,32.07 87.15,32.07 JOYSTICK.B1A | 90.65,30.8 93.66,30.8 95.09,29.37 102.39,29.37 106.36,25.4 106.36,24.92 IC5.1 | 90.65,30.8 90.65,29.84 R4.2
GND  (via drill 0.61)
  Top 0.406: U$8.P$1 131.6,3.65 131.6,35.4 U$6.P$1 | B1ALT.P$1 15.4,24.13 12.38,24.13 11.91,24.61 10.48,24.61 8.89,23.02 v8.26,23.02 8.26,22.86 5.87,20.48 5.87,18.89 8.65,16.11 | 8.65,16.11 8.89,15.88 12.54,15.88 13.18,15.24 15.4,15.24 B2.P$1 | v3.65,19.68 3.65,18.89 1.11,16.35 1.11,6.03 3.49,3.65 U$5.P$1 | 8.65,16.11 8.1,15.56 8.1,13.49 v8.41,13.18 | B4.P$1 33.34,15.24 33.34,23.97 B3ALT.P$1 33.34,24.13 33.34,28.1 | 33.34,28.1 33.34,32.86 B3.P$1 | SERIAL2.1 50.16,30.48 48.74,31.91 45.88,31.91 42.86,28.89 | 42.86,28.89 42.07,28.1 33.34,28.1 | 42.86,28.89 v43.18,28.57 | SSW1.3 59.05,17.94 63.98,22.86 66.2,22.86 SSW2.1 66.2,22.7 66.2,13.18 SSW1ALT.1 | SSW1.1 66.36,3.49 75.88,3.49 U$18.P$1 | SSW2.3 58.9,37.31 58.9,36.04 58.74,35.88 58.74,34.92 59.53,34.13 74.61,34.13 75.88,35.4 U$21.P$1 | v24.77,7.14 v11.11,7.14 | B8.P$1 114.14,15.08 106.52,15.08 100.81,9.37 92.87,9.37 JOYSTICK.H3
  Bottom 0.406: C1.1 3.85,8.04 4.19,8.38 4.19,9.3 IC1.10 | 110.17,25.72 109.22,25.72 C18.2 | 110.17,25.72 111.76,24.13 114.14,24.13 B7ALT.P$1 114.14,23.81 114.14,15.24 B8.P$1 | C15.2 100.33,30.96 101.76,30.96 IC5.9 101.92,30.8 101.92,30.32 102.23,30 102.87,30 103.19,30.32 103.19,30.8 IC5.11 103.19,31.11 103.19,31.59 103.98,32.38 C16.2 104.46,32.54 105.25,33.34 107.95,33.34 C17.2 108.27,33.34 108.58,33.02 111.6,33.02 | 111.6,33.02 114.14,33.02 B7.P$1 114.3,33.02 120.02,33.02 122.87,35.88 131.13,35.88 131.44,35.56 U$6.P$1 | 110.17,25.72 110.17,31.43 111.6,32.86 111.6,33.02 | U$15.P$1 3.65,35.4 3.65,31.27 C2.2 3.81,31.11 3.81,29.84 IC2.14 3.49,29.69 2.22,29.69 0.48,27.94 0.48,17.94 1.59,16.83 IC1.15 1.59,16.67 1.59,10.95 0.95,10.32 0.95,8.57 1.43,8.1 3.65,8.1 C1.1 | v8.26,23.02 8.41,23.18 9.37,23.18 IC2.25 | IC2.23 9.53,24.61 14.92,24.61 15.4,24.13 B1ALT.P$1 15.56,24.13 15.56,32.86 B1.P$1 | IC1.2 9.53,9.53 10,9.53 IC1.1 | 9.53,8.57 9.53,9.37 IC1.2 | 9.53,8.57 7.62,6.67 4.76,6.67 | 4.76,6.67 3.97,7.46 C1.1 | v3.65,19.68 3.65,21.27 IC2.1 | 4.76,6.67 4.76,4.76 U$5.P$1 | v8.41,13.18 8.1,13.18 6.99,12.06 6.99,11.43 7.78,10.64 9.21,10.64 9.53,10.32 9.53,9.68 IC1.2 | 47.62,9.21 49.05,9.21 50.32,7.94 C4.2 | 47.62,9.21 46.2,9.21 IC3.1 | IC3.4 46.2,11.27 46.2,11.75 IC3.5 | 47.15,11.11 46.2,11.11 IC3.4 | 47.15,11.11 47.62,11.11 | 47.62,11.11 50.01,11.11 | 50.01,11.11 51.91,11.11 IC3.25 | IC3.23 51.91,12.54 51.28,12.54 50.01,11.27 50.01,11.11 | 47.62,11.11 47.62,9.21 | 47.07,19.29 47.78,20 C3.2 47.78,20.16 45.88,22.07 45.88,23.34 C10.2 45.72,23.5 44.93,24.29 44.93,26.04 45.32,26.43
  Bottom 0.406: 47.07,19.29 46.2,18.41 46.2,17.78 IC3.14 | 45.32,26.43 45.72,26.83 C9.2 | 47.15,11.11 47.15,19.21 47.07,19.29 | C11.2 50.48,32.54 50.48,33.81 50.64,33.97 U$19.L3 | 50.8,35.72 50.8,34.29 U$19.L3 | 50.8,35.72 50.8,36.2 U$19.L2 | 54.13,32.54 50.96,35.72 50.8,35.72 | 54.13,32.54 58.9,27.78 SSW1ALT.3 | 54.13,32.54 58.9,37.31 SSW2.3 | SERIAL2.1 50.8,33.97 U$19.L3 | v43.18,28.57 45.32,26.43 | SSW1.1 66.2,3.49 66.2,13.02 SSW1ALT.1 | JOYSTICK.V3 80.17,16.99 81.28,18.1 82.55,18.1 C6.2 82.71,18.1 85.57,18.1 92.08,11.59 C7.2 92.23,11.43 92.23,9.84 92.71,9.37 JOYSTICK.H3 92.87,9.21 96.52,5.56 101.12,5.56 102.63,7.06 | 102.63,7.06 103.35,7.78 103.35,9.53 C5.1 | 101.92,13.97 102.87,13.97 103.82,13.02 103.82,11.75 IC4.10 | 101.92,13.97 99.85,11.91 99.85,9.84 102.63,7.06 | 87.87,27.86 87.15,27.15 JOYSTICK.B2A 86.84,27.15 84.3,27.15 76.04,35.4 U$21.P$1 75.72,35.56 66.36,26.19 66.36,23.02 SSW2.1 | 87.87,27.86 88.74,28.73 88.74,29.05 C8.2 | 87.87,27.86 101.76,13.97 101.92,13.97 | v11.11,7.14 9.68,8.57 9.53,8.57 | v24.77,7.14 31.75,7.14 34.77,10.16 43.5,10.16 44.61,11.27 46.04,11.27 IC3.4
  pour Top: 0,0 135.89,0 135.89,39.37 0,39.37
  pour Bottom: 0,0 135.89,0 135.89,39.37 0,39.37
GPA0  (via drill 0.41)
  Top 0.203: v8.26,19.53 11.91,23.18 v11.91,23.34 | v15.24,21.75 16.67,20.32 v20.95,20.32 | v24.45,17.14 24.45,16.67 25.4,15.72 v26.04,15.72 | v30.48,28.73 30.48,31.11 31.59,32.23 31.91,32.23 32.54,31.59 v32.54,30.8 | v52.39,37.31 52.7,37.31 58.26,31.75 69.85,31.75 70.64,30.96 90.33,30.96 95.57,36.2 115.89,36.2 v120.49,31.59
  Bottom 0.203: v8.26,19.53 7.14,18.41 6.35,18.41 5.56,17.62 5.56,16.83 IC1.21 | v11.91,23.34 13.65,23.34 v15.24,21.75 | v20.95,20.32 22.86,20.32 24.29,18.89 24.29,17.3 v24.45,17.14 | v26.04,15.72 26.67,15.72 31.91,20.95 31.91,26.19 31.11,26.99 30.8,26.99 30.16,27.62 30.16,28.42 v30.48,28.73 | v32.54,30.8 33.66,30.8 38.73,35.88 45.88,35.88 46.35,35.4 49.21,35.4 49.85,36.04 49.85,36.67 50.48,37.31 v52.39,37.31 | v120.49,31.59 125.41,26.67 125.41,19.53 121.92,16.03 121.92,15.24 B8.P$1A
GPA1  (via drill 0.41)
  Top 0.203: v6.19,15.08 7.46,13.81 7.46,13.02 v10.95,9.53 | v35.08,3.17 v17.3,3.17 | v38.73,2.54 54.13,2.54 60.48,8.89 v79.85,8.89 | v83.03,5.71 100.49,5.71 100.65,5.56 118.59,5.56 125.41,12.38 125.41,22.54 123.98,23.97 122.4,23.97 | 122.4,23.97 121.92,23.97 B7ALT.P$1A 122.4,23.97 | 122.4,23.97 122.4,27.94 121.92,28.42 121.92,32.86 B7.P$1A
  Bottom 0.203: v6.19,15.08 6.19,16.67 IC1.22 | v17.3,3.17 v10.95,9.53 | v35.08,3.17 35.72,2.54 v38.73,2.54 | v83.03,5.71 v79.85,8.89
GPA4  (via drill 0.41)
  Top 0.203: v8.26,18.57 11.91,22.23 11.91,22.38 12.7,23.18 14.61,23.18 15.08,22.7 v21.75,22.7
  Bottom 0.203: v8.26,18.57 8.26,16.83 IC1.25 | v21.75,22.7 23.02,23.97 B1ALT.P$1A 23.18,24.13 23.18,32.86 B1.P$1A
GPA5  (via drill 0.41)
  Top 0.203: v8.89,15.08 12.54,15.08 13.81,13.81 16.03,13.81 17.3,15.08 23.02,15.08 B2.P$1A
  Bottom 0.203: v8.89,15.08 8.89,16.67 IC1.26
GPA6  (via drill 0.41)
  Top 0.203: v9.53,18.1 14.29,18.1 15.88,16.51 22.7,16.51 v25.08,18.89 | v29.69,29.53 29.69,30.96 32.86,34.13 39.69,34.13 40.8,33.02 B3.P$1A 40.8,32.86 v40.8,28.89
  Bottom 0.203: v9.53,18.1 9.53,16.83 IC1.27 | v25.08,18.89 25.4,18.89 25.88,19.37 28.73,19.37 30.16,20.8 30.16,21.11 29.69,21.59 v29.69,29.53 | v40.8,28.89 40.8,24.13 B3ALT.P$1A
GPA7  (via drill 0.41)
  Top 0.203: v12.06,11.59 v9.84,13.81 | v13.97,9.68 23.34,9.68 27.62,5.4 33.34,5.4 34.61,4.13 36.35,4.13 40.8,8.57 40.8,15.08 B4.P$1A
  Bottom 0.203: v9.84,13.81 10,13.97 10,16.67 IC1.28 | v13.97,9.68 v12.06,11.59
I2C_SCL  (via drill 0.41)
  Top 0.203: v15.08,18.26 v12.86,20.48 | v4.45,11.75 v7.78,11.75 | v106.05,26.67 106.05,16.67 v102.55,13.18 v99.54,13.18 | 50.16,13.97 50.16,19.21 v52.39,21.43 | 50.16,13.97 v50.16,10.32 | v67.15,25.4 66.83,25.4 60.96,31.27 57.15,31.27 53.18,27.3 53.18,27.15 52.55,26.51 51.59,26.51 51.44,26.67 49.53,26.67 SERIAL2.4 | 50.16,13.97 v41.43,5.24
  Bottom 0.203: v12.86,20.48 10.79,22.54 9.53,22.54 IC2.26 | v15.08,18.26 15.08,16.67 13.02,14.61 | 13.02,14.61 10.16,11.75 v7.78,11.75 | v4.45,11.75 3.02,10.32 3.02,9.53 IC1.12 | v106.05,26.67 106.05,29.05 105.25,29.84 105.25,30.96 IC5.14 | v102.55,13.18 102.55,11.75 IC4.12 | v50.16,10.32 50.32,10.48 51.91,10.48 IC3.26 | v52.39,21.43 52.39,25.72 51.44,26.67 49.53,26.67 SERIAL2.4 | v99.54,13.18 88.9,23.81 83.98,23.81 83.66,24.13 68.42,24.13 v67.15,25.4 | 13.02,14.61 15.56,12.06 15.56,9.68 16.03,9.21 16.03,8.26 18.57,5.71 36.67,5.71 37.15,5.24 v41.43,5.24
I2C_SDA  (via drill 0.41)
  Top 0.203: v100.65,10.32 106.84,16.51 v106.84,28.89 112.87,28.89 114.3,30.32 114.3,30.64 110.17,34.77 97.63,34.77 87,24.13 79.06,24.13 66.52,11.59 59.37,11.59 58.26,10.48 51.28,10.48 | v4.6,18.1 4.6,15.56 v2.54,13.49 | 51.28,10.48 52.39,11.59 v52.39,20.48 | 51.28,10.48 50.8,10 v50.8,9.53 47.31,9.53 42.23,4.45 v40.64,4.45 | v28.26,12.38 28.26,11.43 v34.77,4.92
  Bottom 0.203: v106.84,28.89 105.89,29.84 105.89,30.96 IC5.15 | v100.65,10.32 101.28,10.32 101.76,10.79 101.76,11.59 IC4.13 | v4.6,18.1 8.41,21.91 9.37,21.91 IC2.27 9.53,21.91 10.79,21.91 12.06,20.64 12.06,20.32 12.7,19.68 15.4,19.68 15.56,19.84 16.51,19.84 17.78,18.57 22.07,18.57 v28.26,12.38 | v2.54,13.49 2.54,10.48 2.38,10.32 2.38,9.53 IC1.13 | v50.8,9.53 51.12,9.84 51.91,9.84 IC3.27 | v52.39,20.48 53.18,21.27 53.18,25.56 SERIAL2.3 | v34.77,4.92 36.83,4.92 37.31,4.45 v40.64,4.45
JOY_1  (via drill 0.41)
  Top 0.203: v96.68,22.7 93.19,22.7 90.49,20 v83.66,20
  Bottom 0.203: v96.68,22.7 99.69,25.72 104.78,25.72 105.09,25.4 105.09,24.92 IC5.3 | v83.66,20 82.55,20 C6.1 82.55,19.84 82.23,19.53 80.17,19.53 JOYSTICK.V2
JOY_2  (via drill 0.41)
  Top 0.203: v104.46,23.5 90.33,9.37 JOYSTICK.H2
  Bottom 0.203: v104.46,23.5 104.46,24.77 IC5.4 | C7.1 90.33,11.43 90.33,9.37 JOYSTICK.H2
L0
  Top 0.203: B1ALT.G(-) 21.75,17.62 21.75,18.57 23.81,20.64 23.81,22.86 24.45,23.5 24.45,24.45 22.54,26.35 21.75,26.35 B1.G(-)
  Bottom 0.203: R20.1 21.75,27.94 21.75,26.51 B1.G(-)
L0B
  Bottom 0.203: 20.16,31.27 20.16,30.32 B1.B(-) | 20.16,31.27 20.16,31.91 R34.1 | 20.16,31.27 22.07,31.27 22.7,30.64 22.7,25.72 20.16,23.18 20.16,21.43 B1ALT.B(-)
L1
  Top 0.203: B1ALT.R(-) 20.16,17.62 22.7,20.16 22.7,22.7 20.16,25.24 20.16,26.35 B1.R(-)
  Bottom 0.203: R19.1 20.16,24.92 20.16,26.35 B1.R(-)
L1B
  Bottom 0.203: R33.1 18.73,14.29 18.73,13.81 20,12.54 B2.B(-)
L2
  Bottom 0.203: R18.1 21.59,10.32 21.59,8.73 B2.G(-)
L2B  (via drill 0.41)
  Top 0.203: v41.59,27.15 37.94,23.5 37.94,21.43 B3ALT.B(-)
  Bottom 0.203: R32.1 37.94,31.75 37.94,30.32 B3.B(-) 37.94,30.16 38.89,29.21 39.85,29.21 40.32,29.69 40.96,29.69 41.59,29.05 v41.59,27.15
L3
  Bottom 0.203: R17.1 20.16,10.16 20.16,8.73 B2.R(-)
L3B
  Bottom 0.203: R31.1 36.51,14.13 36.51,13.81 37.78,12.54 B4.B(-)
L4  (via drill 0.41)
  Top 0.203: v41.27,20.8 39.53,19.05 39.53,17.62 B3ALT.G(-)
  Bottom 0.203: B3.G(-) 39.37,26.35 39.21,26.19 39.21,24.92 R16.1 39.21,24.77 39.21,23.97 41.27,21.91 v41.27,20.8
L5  (via drill 0.41)
  Top 0.203: v36.2,25.08 36.51,25.08 37.78,26.35 B3.R(-)
  Bottom 0.203: R15.1 37.94,28.1 37.94,26.51 B3.R(-) | v36.2,25.08 33.81,22.7 33.81,20.95 34.45,20.32 35.08,20.32 37.78,17.62 B3ALT.R(-)
L6
  Bottom 0.203: R14.1 40.01,6.99 40.01,8.1 39.53,8.57 B4.G(-)
L6B
  Top 0.203: B7ALT.B(-) 118.75,21.43 118.75,22.07 114.62,26.19 114.62,26.83 117,29.21 117.79,29.21 118.75,30.16 B7.B(-)
  Bottom 0.203: R28.1 118.75,31.75 118.75,30.32 B7.B(-)
L7
  Bottom 0.203: R13.1 37.94,7.14 37.94,8.57 B4.R(-)
L7B
  Bottom 0.203: R27.1 116.52,10.16 118.75,12.38 B8.B(-)
L12  (via drill 0.41)
  Top 0.203: v121.28,22.38 121.28,20.95 120.33,20 120.33,17.62 B7ALT.G(-)
  Bottom 0.203: 119.86,24.77 119.86,26.04 120.17,26.35 B7.G(-) | v121.28,22.38 121.28,22.7 119.86,24.13 119.86,24.77 | 119.86,24.77 R8.1
L13  (via drill 0.41)
  Top 0.203: v123.03,18.89 120.65,16.51 119.86,16.51 118.9,17.46 B7ALT.R(-)
  Bottom 0.203: 118.59,27.46 118.59,26.67 118.75,26.51 B7.R(-) | 118.59,27.46 118.59,27.94 R7.1 | v123.03,18.89 123.03,25.24 120.81,27.46 118.59,27.46
L14
  Bottom 0.203: R6.1 120.17,6.35 120.17,8.57 B8.G(-)
L15
  Bottom 0.203: R5.1 117.79,7.62 118.75,8.57 B8.R(-)
N$1
  Bottom 0.406: L4.1 45.88,32.38 48.58,32.38 C11.1 48.26,32.23 SERIAL2.2
N$2  (via drill 0.41)
  Top 0.203: v44.93,17.3 46.35,17.3 50.64,21.59 51.59,21.59 52.23,22.23 52.55,22.23 53.18,21.59 53.18,20 53.02,19.84 53.02,16.99 58.1,11.91 59.05,11.91 v61.44,14.29
  Bottom 0.203: v44.93,17.3 45.09,17.14 46.04,17.14 IC3.13 | v61.44,14.29 65.56,14.29 65.72,14.45 69.69,14.45 81.76,2.38 104.3,2.38 112.08,10.16 R27.2
N$3  (via drill 0.41)
  Top 0.203: v44.93,16.35 44.93,13.81 45.56,13.18 45.56,12.54 36.35,3.33 v36.04,3.33 | v39.53,3.33 43.02,3.33 43.18,3.17 50.32,3.17 56.83,9.68 63.34,9.68 64.77,11.11 67.31,11.11 79.85,23.65 92.87,23.65 100.01,30.8 110.65,30.8 110.97,30.48 v113.51,30.48
  Bottom 0.203: v44.93,16.35 46.04,16.35 IC3.12 | v39.53,3.33 v36.04,3.33 | v113.51,30.48 114.46,30.48 115.73,31.75 117,31.75 R28.2
N$4  (via drill 0.41)
  Top 0.203: v4.76,29.21 4.76,27.94 4.13,27.3 4.13,25.72 4.76,25.08 7.14,25.08 10.32,28.26 16.51,28.26 16.83,28.57 20.95,28.57 27.78,21.75 27.78,14.13 v34.61,7.3
  Bottom 0.203: v4.76,29.21 3.81,29.21 IC2.13 | v34.61,7.3 36.04,7.3 36.2,7.14 R13.2
N$5  (via drill 0.41)
  Top 0.203: v12.7,38.1 19.37,38.1 v20.64,36.83 | v32.54,27.62 32.54,24.92 31.91,24.29 31.91,15.72 v29.53,13.34 | v29.05,11.75 29.05,11.27 34.29,6.03 v37.31,6.03
  Bottom 0.203: v12.7,38.1 9.21,34.61 9.21,32.07 7.62,30.48 7.14,30.48 5.08,28.42 3.81,28.42 IC2.12 | v20.64,36.83 22.07,36.83 22.23,36.99 24.92,36.99 28.89,33.02 28.89,31.27 v32.54,27.62 | v29.53,13.34 29.53,12.22 v29.05,11.75 | v37.31,6.03 40.64,6.03 41.59,6.99 R14.2
N$7  (via drill 0.41)
  Top 0.203: v5.56,27.94 5.56,30.32 v7.78,32.54 | v7.78,35.08 8.1,35.08 10.32,37.31 12.86,37.31 13.18,37.62 18.73,37.62 21.75,34.61 24.29,34.61 26.35,32.54 v29.69,32.54
  Bottom 0.203: v5.56,27.94 3.81,27.94 IC2.11 | v7.78,35.08 v7.78,32.54 | v29.69,32.54 33.97,28.26 36.2,28.26 R15.2
N$9  (via drill 0.41)
  Top 0.203: v4.92,27.15 6.19,27.15 v12.06,33.02 | v13.97,33.02 15.08,34.13 19.21,34.13 24.13,29.21 24.92,29.21 v25.08,29.37 | v30.96,27.78 v25.08,27.78 | v36.2,24.13 v35.24,25.08
  Bottom 0.203: v4.92,27.15 3.81,27.15 IC2.10 | v13.97,33.02 v12.06,33.02 | v25.08,27.78 v25.08,29.37 | v30.96,27.78 31.43,27.78 34.13,25.08 v35.24,25.08 | v36.2,24.13 36.67,24.13 37.31,24.77 R16.2
N$10  (via drill 0.41)
  Top 0.203: v2.54,27.15 2.54,28.26 10.64,36.35 13.18,36.35 13.49,36.67 17.62,36.67 v24.29,30 | v24.61,20.95 26.83,18.73 26.83,15.56 25.4,14.13 23.97,14.13 23.65,13.81 v16.99,13.81
  Bottom 0.203: v2.54,27.15 3.17,26.51 3.65,26.51 IC2.9 | v24.29,30 24.29,24.61 24.61,24.29 v24.61,20.95 | v16.99,13.81 16.03,12.86 16.03,12.06 17.78,10.32 18.41,10.32 R17.2
N$11  (via drill 0.41)
  Top 0.203: v1.75,28.1 10.48,36.83 13.02,36.83 13.34,37.15 18.57,37.15 21.59,34.13 23.65,34.13 v26.83,30.96 | v26.83,20.16 26.83,19.37 27.3,18.89 27.3,13.18 24.61,10.48 v24.45,10.48
  Bottom 0.203: v1.75,28.1 1.75,26.99 2.86,25.88 3.65,25.88 IC2.8 | v26.83,20.16 v26.83,30.96 | v24.45,10.48 23.34,10.48 R18.2
N$12  (via drill 0.41)
  Top 0.203: v4.92,25.88 5.87,25.88 v15.88,35.88 | v31.75,31.43 31.75,26.19 31.91,26.04 31.91,24.92 28.57,21.59 v28.57,18.57 | v26.04,18.57 26.04,18.89 25.24,19.68 23.81,19.68 v23.18,19.05
  Bottom 0.203: v4.92,25.88 4.29,25.24 3.81,25.24 IC2.7 | v15.88,35.88 18.57,35.88 20.32,37.62 25.56,37.62 v31.75,31.43 | v26.04,18.57 v28.57,18.57 | v23.18,19.05 17.94,19.05 16.03,20.95 16.03,22.23 18.57,24.77 R19.2
N$14  (via drill 0.41)
  Top 0.203: v44.13,15.72 42.07,15.72 41.43,16.35 39.69,16.35 v38.73,15.4
  Bottom 0.203: v44.13,15.72 45.4,14.45 46.04,14.45 IC3.9 | v38.73,15.4 38.73,14.76 38.26,14.29 R31.2
N$15  (via drill 0.41)
  Top 0.203: v42.39,29.53 42.39,30.48 v41.59,31.27
  Bottom 0.203: v42.39,29.53 42.39,16.51 45.09,13.81 46.04,13.81 IC3.8 | v41.59,31.27 40.01,31.27 37.94,33.34 R32.2
N$16  (via drill 0.41)
  Top 0.203: v44.77,13.02 44.77,12.7 v43.02,10.95
  Bottom 0.203: v44.77,13.02 46.04,13.02 IC3.7 | v43.02,10.95 24.92,10.95 21.59,14.29 20.32,14.29 R33.2
N$17  (via drill 0.41)
  Top 0.203: v29.37,20.95 v29.37,16.51
  Bottom 0.203: v29.37,16.51 34.45,11.43 39.85,11.43 40.32,11.91 44.61,11.91 45.24,12.54 46.04,12.54 IC3.6 | v29.37,20.95 29.37,21.27 27.62,23.02 27.62,31.11 24.61,34.13 20.8,34.13 20.32,33.66 R34.2
N$19  (via drill 0.41)
  Top 0.203: v4.92,24.29 6.99,24.29 8.26,25.56 11.75,25.56 12.54,24.77 13.97,24.77 v16.99,27.78
  Bottom 0.203: v4.92,24.29 4.76,24.45 3.81,24.45 IC2.6 | v16.99,27.78 19.68,27.78 19.84,27.94 R20.2
N$24  (via drill 0.41)
  Top 0.203: v84.77,31.75 v70.8,31.75 | v104.3,33.5 108.9,33.5 v111.12,31.27
  Bottom 0.203: v70.8,31.75 63.98,38.58 15.4,38.58 11.11,34.29 11.11,28.26 10,27.15 IC2.19 | v84.77,31.75 86.52,33.5 v104.3,33.5 | v111.12,31.27 111.12,29.69 116.05,24.77 R8.2
N$25  (via drill 0.41)
  Top 0.203: v17.78,33.34 v14.76,30.32 | v21.27,36.04 23.34,38.1 52.55,38.1 58.1,32.54 v73.82,32.54 | v88.74,24.61 93.19,24.61 102.87,34.29 109.06,34.29 v112.08,31.27
  Bottom 0.203: v14.76,30.32 10.95,26.51 IC2.20 | v17.78,33.34 17.78,34.45 19.37,36.04 v21.27,36.04 | v73.82,32.54 74.14,32.54 82.07,24.61 v88.74,24.61 | v112.08,31.27 112.08,30.96 114.94,28.1 116.84,28.1 R7.2
N$26  (via drill 0.41)
  Top 0.203: v14.76,29.05 23.65,29.05 24.13,28.57 26.67,28.57 32.7,34.61 42.07,34.61 43.81,32.86 v51.59,32.86 | v58.58,25.88 58.58,25.4 59.85,24.13 v61.59,24.13 | v117.32,6.35 v100.81,6.35
  Bottom 0.203: v14.76,29.05 11.59,25.88 9.53,25.88 IC2.21 | v58.58,25.88 v51.59,32.86 | v61.59,24.13 61.59,23.81 64.14,21.27 64.45,21.27 65.09,21.91 65.41,21.91 65.72,21.59 66.67,21.59 68.74,23.65 83.5,23.65 v100.81,6.35 | R6.2 v117.32,6.35
N$27  (via drill 0.41)
  Top 0.203: v8.41,24.77 8.41,24.29 5.24,21.11 5.24,18.41 5.4,18.26 5.4,15.24 v5.24,15.08 | v5.24,10.79 5.24,8.1 12.86,0.48 61.44,0.48 67.94,6.99 100.49,6.99 100.65,7.14 v110.97,7.14
  Bottom 0.203: v8.41,24.77 8.89,25.24 9.37,25.24 IC2.22 | v5.24,10.79 v5.24,15.08 | v110.97,7.14 111.6,7.14 112.08,7.62 R5.2
SDI_MOSI  (via drill 0.41)
  Top 0.203: v67.31,17.78 67.31,22.23 67.47,22.38 67.47,23.5 66.52,24.45 63.18,24.45 63.02,24.61 | 63.02,24.61 62.07,25.56 SSW1ALT.6 | v59.53,29.05 58.74,29.05 57.78,28.1 57.78,25.56 60.01,23.34 60.8,23.34 | 60.8,23.34 61.75,23.34 63.02,24.61 | SERIAL2.8 48.9,22.86 50.16,24.13 55.09,24.13 57.63,21.59 59.05,21.59 60.8,23.34
  Bottom 0.203: v67.31,17.78 64.29,14.76 63.5,14.76 62.39,15.88 62.07,15.88 SSW1.6 | v59.53,29.05 61.91,31.43 61.91,35.24 SSW2.6
SDI_SCLK  (via drill 0.41)
  Top 0.203: v64.29,22.07 63.02,20.8 63.02,17.94 SSW1.7 | SERIAL2.7 55.72,22.86 57.47,21.11 61.12,21.11 v63.18,23.18
  Bottom 0.203: 64.29,23.18 64.29,24.45 65.09,25.24 65.09,26.04 63.5,27.62 | 64.29,23.18 v64.29,22.07 | 63.5,27.62 63.02,27.62 SSW1ALT.7 63.5,27.62 | 63.5,27.62 65.41,29.53 65.41,35.4 63.5,37.31 63.02,37.31 SSW2.7 | 64.29,23.18 v63.18,23.18
SSGPA0  (via drill 0.41)
  Top 0.203: v103.19,16.19 97.79,16.19 91.44,9.84 91.44,8.89 90.01,7.46 62.71,7.46 58.74,3.49 SSW1.2
  Bottom 0.203: v103.19,16.19 105.09,18.1 105.09,18.73 IC4.21 | SSW1ALT.2 58.74,13.02 58.74,12.22 60.33,10.64 60.33,5.08 58.74,3.49 SSW1.2
SSGPA1  (via drill 0.41)
  Top 0.203: v105.73,8.41 v105.73,13.02 | v64.45,9.84 v76.52,9.84 | v59.85,14.45 57.78,16.51 v57.78,18.89
  Bottom 0.203: v105.73,13.02 105.73,18.73 IC4.22 | v105.73,8.41 104.78,8.41 101.28,4.92 81.44,4.92 v76.52,9.84 | v59.85,14.45 v64.45,9.84 | v57.78,18.89 57.78,22.07 58.58,22.86 SSW2.2
SSGPB0  (via drill 0.41)
  Top 0.203: v68.1,19.21 68.1,23.5 66.04,25.56 63.98,25.56 SSW1ALT.8
  Bottom 0.203: 67.47,18.57 68.1,17.94 68.1,16.67 81.92,2.86 101.92,2.86 109.54,10.48 109.54,11.59 IC4.1 | 67.47,18.57 66.52,18.57 63.98,16.03 SSW1.8 | 67.47,18.57 v68.1,19.21
SSGPB1  (via drill 0.41)
  Top 0.203: v72.87,18.89 72.87,22.7 v64.61,30.96
  Bottom 0.203: v72.87,18.89 72.87,12.54 82.07,3.33 101.76,3.33 108.9,10.48 108.9,11.59 IC4.2 | v64.61,30.96 64.61,34.61 63.98,35.24 SSW2.8

### Text on the board
_bsilk: SKAARHOJ 2015 | v11-15 | PCB-CMB-4